# Altium schematic sheet Jukebox Peripherals.SchDoc: Jukebox Peripherals
size B; DrawnBy: Tim Menninger; Revision: 1.1; SheetNumber: 3; SheetTotal: 5
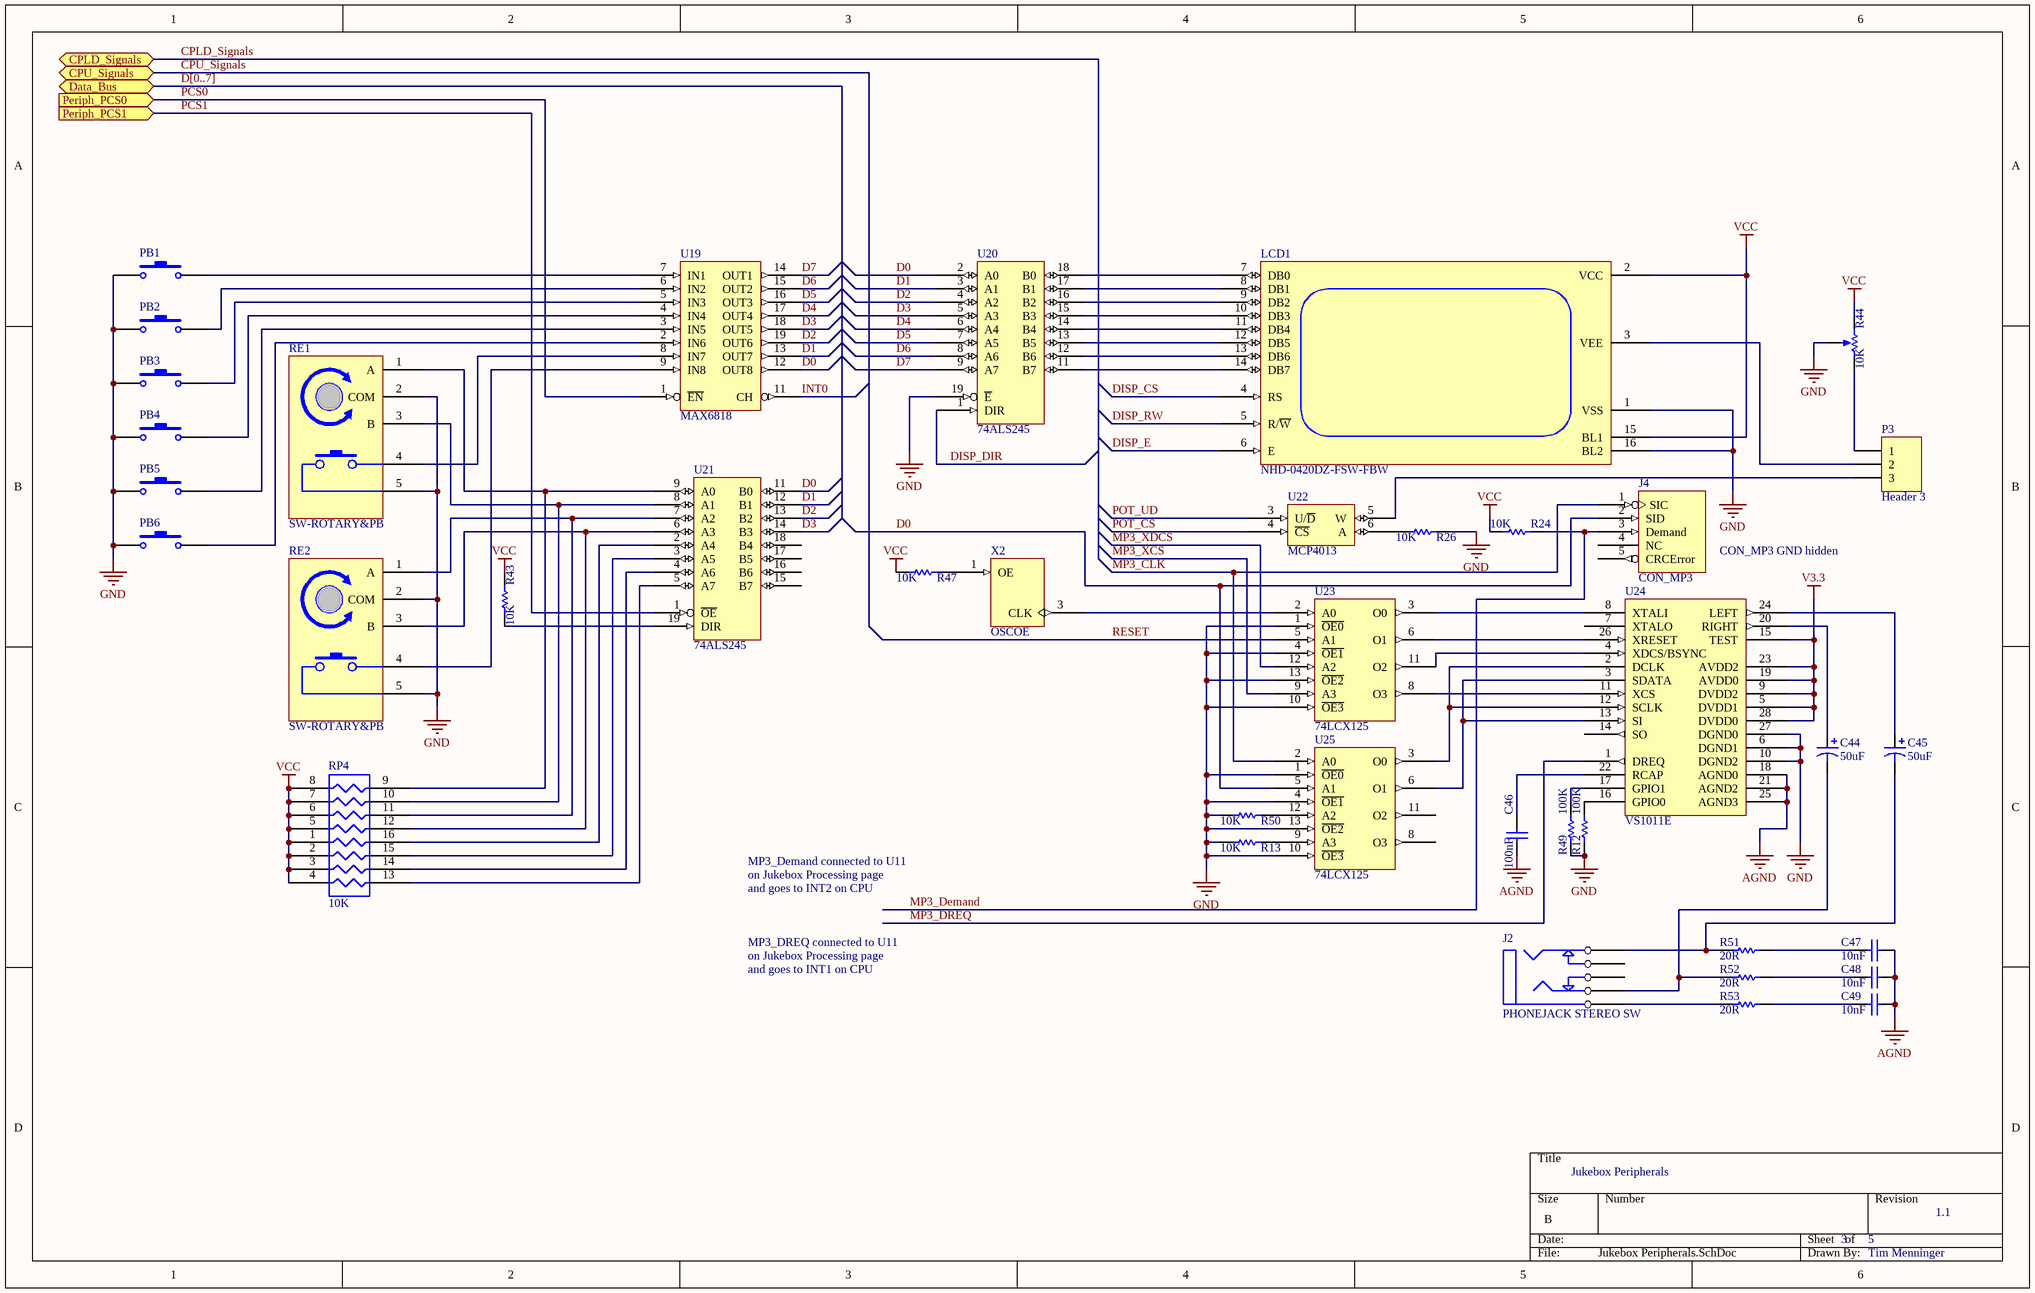
[diagram p0: Jukebox Peripherals.SchDoc]

## Parts
C44  value 50uF  [RB.1/.2]  (hidden comment: Cap Pol3)
C45  value 50uF  [RB.1/.2]  (hidden comment: Cap Pol3)
C46  value 100nF  [C0805]  (hidden comment: Cap)
C47  value 10nF  [C0805]  (hidden comment: Cap)
C48  value 10nF  [C0805]  (hidden comment: Cap)
C49  value 10nF  [C0805]  (hidden comment: Cap)
J2  PHONEJACK STEREO SW  [SJ1-352]
J4  CON_MP3  [MDIN6]
LCD1  NHD-0420DZ-FSW-FBW  [20x4Disp]
P3  Header 3  [HDR1X3]
PB1  SW-PB  [PB_EG4791]  (value not drawn)
PB2  SW-PB  [PB_EG4791]  (value not drawn)
PB3  SW-PB  [PB_EG4791]  (value not drawn)
PB4  SW-PB  [PB_EG4791]  (value not drawn)
PB5  SW-PB  [PB_EG4791]  (value not drawn)
PB6  SW-PB  [PB_EG4791]  (value not drawn)
R12  value 100K  [6-0805_L]  (hidden comment: Res1)
R13  value 10K  [6-0805_L]  (hidden comment: Res1)
R24  value 10K  [6-0805_L]  (hidden comment: Res1)
R26  value 10K  [6-0805_L]  (hidden comment: Res1)
R43  value 10K  [6-0805_L]  (hidden comment: Res1)
R44  value 10K  [VR4]  (hidden comment: RPot)
R47  value 10K  [6-0805_L]  (hidden comment: Res1)
R49  value 100K  [6-0805_L]  (hidden comment: Res1)
R50  value 10K  [6-0805_L]  (hidden comment: Res1)
R51  value 20R  [6-0805_L]  (hidden comment: Res1)
R52  value 20R  [6-0805_L]  (hidden comment: Res1)
R53  value 20R  [6-0805_L]  (hidden comment: Res1)
RE1  SW-ROTARY&PB  [ROTENCPB]
RE2  SW-ROTARY&PB  [ROTENCPB]
RP4  10K  [SSOP16]
U19  MAX6818  [SSOP20]
U20  74ALS245  [SSOP20]
U21  74ALS245  [SSOP20]
U22  MCP4013  [SOT-23-6]
U23  74LCX125  [SOIC 14]
U24  VS1011E  [SOP127P1030X265-28N]
U25  74LCX125  [SOIC 14]
X2  OSCOE  [DIP14-4]

## Ports
CPLD_Signals, CPU_Signals, Data_Bus, Periph_PCS0 (in), Periph_PCS1 (in)

## Nets
AGND: C46.2 C47.2 C48.2 C49.2 U23.7(AGND) U24.18(AGND0) U24.21(AGND2) U24.25(AGND3) U25.7(AGND)
GND: LCD1.1(VSS) LCD1.16(BL2) PB1.1 PB2.1 PB3.1 PB4.1 PB5.1 PB6.1 R12.1 R13.1 R26.2 R44.3(TAP) R49.1 R50.1 RE1.2(COM) RE1.5 RE2.2(COM) RE2.5 U19.10(GND) U20.10(GND) U20.19(~{E}) U21.10(GND) U22.2(GND) U23.1(~{O}~{E}~{0}) U23.4(~{O}~{E}~{1}) U23.10(~{OE3}) U23.13(~{OE2}) U24.6(DGND1) U24.10(DGND2) U24.27(DGND0) U25.1(~{O}~{E}~{0}) U25.4(~{O}~{E}~{1}) U25.10(~{OE3}) U25.13(~{OE2}) X2.2(GND)
V3.3: U23.14(VCC) U24.5(DVDD1) U24.9(DVDD2) U24.15(TEST) U24.19(AVDD0) U24.23(AVDD2) U24.28(DVDD0) U25.14(VCC)
VCC: LCD1.2(VCC) LCD1.15(BL1) R24.1 R43.1 R44.1(TOP) R47.1 RP4.1 RP4.2 RP4.3 RP4.4 RP4.5 RP4.6 RP4.7 RP4.8 U19.20(VCC) U20.20(VCC) U21.20(VCC) U22.1(VCC) X2.4(VCC)
D0: J4.2(SID) U19.12(OUT8) U20.2(A0) U21.11(B0) U25.5(A1)
D1: U19.13(OUT7) U20.3(A1) U21.12(B1)
D2: U19.19(OUT6) U20.4(A2) U21.13(B2)
D3: U19.18(OUT5) U20.5(A3) U21.14(B3)
D4: U19.17(OUT4) U20.6(A4)
D5: U19.16(OUT3) U20.7(A5)
D6: U19.15(OUT2) U20.8(A6)
D7: U19.14(OUT1) U20.9(A7)
DISP_CS: LCD1.4(RS)
DISP_DIR: U20.1(DIR)
DISP_E: LCD1.6(E)
DISP_RW: LCD1.5(R/~{W})
INT0: U19.11(CH)
MP3_CLK: J4.1(SIC) U25.2(A0)
MP3_Demand: J4.3(Demand) R24.2
MP3_DREQ: U24.1(DREQ)
MP3_XCS: U23.9(A3)
MP3_XDCS: U23.12(A2)
PCS0: U19.1(~{EN}) ; port Periph_PCS0
PCS1: U21.1(~{OE}) ; port Periph_PCS1
POT_CS: U22.4(~{CS})
POT_UD: U22.3(U/~{D})
RESET: U23.5(A1)
NetC44_1: C44.1 U24.20(RIGHT)
NetC44_2: C44.2 J2.D(TIP) R52.2
NetC45_1: C45.1 U24.24(LEFT)
NetC45_2: C45.2 J2.A(RING) R51.2
NetC46_1: C46.1 U24.22(RCAP)
NetC47_1: C47.1 R51.1
NetC48_1: C48.1 R52.1
NetC49_1: C49.1 R53.1
NetJ2_E: J2.E(SLEEVE) R53.2
NetLCD1_3: LCD1.3(VEE) P3.2
NetLCD1_7: LCD1.7(DB0) U20.18(B0)
NetLCD1_8: LCD1.8(DB1) U20.17(B1)
NetLCD1_9: LCD1.9(DB2) U20.16(B2)
NetLCD1_10: LCD1.10(DB3) U20.15(B3)
NetLCD1_11: LCD1.11(DB4) U20.14(B4)
NetLCD1_12: LCD1.12(DB5) U20.13(B5)
NetLCD1_13: LCD1.13(DB6) U20.12(B6)
NetLCD1_14: LCD1.14(DB7) U20.11(B7)
NetP3_1: P3.1 R44.2(BOT)
NetP3_3: P3.3 U22.5(W)
NetPB1_2: PB1.2 U19.7(IN1)
NetPB2_2: PB2.2 U19.6(IN2)
NetPB3_2: PB3.2 U19.5(IN3)
NetPB4_2: PB4.2 U19.4(IN4)
NetPB5_2: PB5.2 U19.3(IN5)
NetPB6_2: PB6.2 U19.2(IN6)
NetR12_2: R12.2 U24.16(GPIO0)
NetR13_2: R13.2 U25.9(A3)
NetR26_1: R26.1 U22.6(A)
NetR43_2: R43.2 U21.19(DIR)
NetR47_2: R47.2 X2.1(OE)
NetR49_2: R49.2 U24.17(GPIO1)
NetR50_2: R50.2 U25.12(A2)
NetRE1_1: RE1.1(A) RP4.9 U21.9(A0)
NetRE1_3: RE1.3(B) RP4.10 U21.8(A1)
NetRE1_4: RE1.4 U19.8(IN7)
NetRE2_1: RE2.1(A) RP4.11 U21.7(A2)
NetRE2_3: RE2.3(B) RP4.12 U21.6(A3)
NetRE2_4: RE2.4 U19.9(IN8)
NetRP4_13: RP4.13 U21.5(A7)
NetRP4_14: RP4.14 U21.4(A6)
NetRP4_15: RP4.15 U21.3(A5)
NetRP4_16: RP4.16 U21.2(A4)
NetU23_2: U23.2(A0) X2.3(CLK)
NetU23_3: U23.3(O0) U24.8(XTALI)
NetU23_6: U23.6(O1) U24.26(XRESET)
NetU23_8: U23.8(O3) U24.11(XCS)
NetU23_11: U23.11(O2) U24.4(XDCS/BSYNC)
NetU24_2: U24.2(DCLK) U24.12(SCLK) U25.3(O0)
NetU24_3: U24.3(SDATA) U24.13(SI) U25.6(O1)

Not connected (* = marked no-connect by the designer): J2 B(RINGSW) C(TIPSW); J4 4(NC) 5(CRCError) 6(GND); U21 15(B7) 16(B6) 17(B5) 18(B4); U24 7(XTALO) 14(SO); U25 8(O3) 11(O2)

## Buses and harness runs
bus CPLD_Signals = port CPLD_Signals
bus CPU_Signals = port CPU_Signals
bus D[0..7] = port Data_Bus

## Notes on the sheet
- CON_MP3 GND hidden
- MP3_Demand connected to U11
- on Jukebox Processing page
- and goes to INT2 on CPU
- MP3_DREQ connected to U11
- and goes to INT1 on CPU

## Library data of the parts
C44 C45 = Cap Pol3: Polarized Capacitor (Surface Mount); Published: 8-Jun-2000; LatestRevisionDate: 29-May-2009; LatestRevisionNote: IPC-7351 Footprint Added.; PackageReference: C0805; Publisher: Altium Limited; PackageDescription: Chip Capacitor
C46-C49 = Cap: Capacitor; Published: 8-Jun-2000; LatestRevisionDate: 17-Jul-2002; LatestRevisionNote: Re-released for DXP Platform.; PackageReference: RAD-0.3; Publisher: Altium Limited; PackageDescription: Radial Cap, Thru-Hole; 2 Leads; 0.3 in Pin Spacing
J2 = PHONEJACK STEREO SW: 3.5mm Stereo Jack with Switches
J4 = CON_MP3: MP3 Connector
LCD1 = LCDBL16PIN: Single E LCD with Backlight
P3 = Header 3: Header, 3-Pin; LatestRevisionDate: 17-Jul-2002; LatestRevisionNote: Re-released for DXP Platform.; Publisher: Altium Limited
PB1-PB6 = SW-PB: Switch; Published: 24-Mar-1999; LatestRevisionDate: 17-Jul-2002; LatestRevisionNote: Re-released for DXP Platform.; PackageReference: SPST-2; Publisher: Altium Limited; PackageDescription: Switch; 2 Leads
R12 R13 R24 R26 R43 R47 R49-R53 = Res1: Resistor; Published: 8-Jun-2000; LatestRevisionDate: 17-Jul-2002; LatestRevisionNote: Re-released for DXP Platform.; PackageReference: AXIAL-0.3; Publisher: Altium Limited; PackageDescription: Axial Device, Thru-Hole; 2 Leads; 0.3 in Pin Spacing
R44 = RPot: Potentiometer; Sim Note: Enter the Resistance value and the set point into parameter fields.; Set Position: 0.5; Published: 8-Jun-2000; LatestRevisionDate: 17-Jul-2002; LatestRevisionNote: Re-released for DXP Platform.; PackageReference: VR5; Publisher: Altium Limited; PackageDescription: Variable Resistor, Thru-Hole; 3 Leads
RE1 RE2 = SW-ROTARY&PB: Rotary Encoder with Built-In Push Button
RP4 = RPACK8: Resistor Pack - 8 Resistors
U19 = MAX6818: Octal Switch Debouncer
U20 U21 = 74ALS245: Octal Bus Transceiver
X2 = OSCOE: Oscillator with Active High Output Enable